# EAGLE design HABduino41 (EAGLE 6.4)
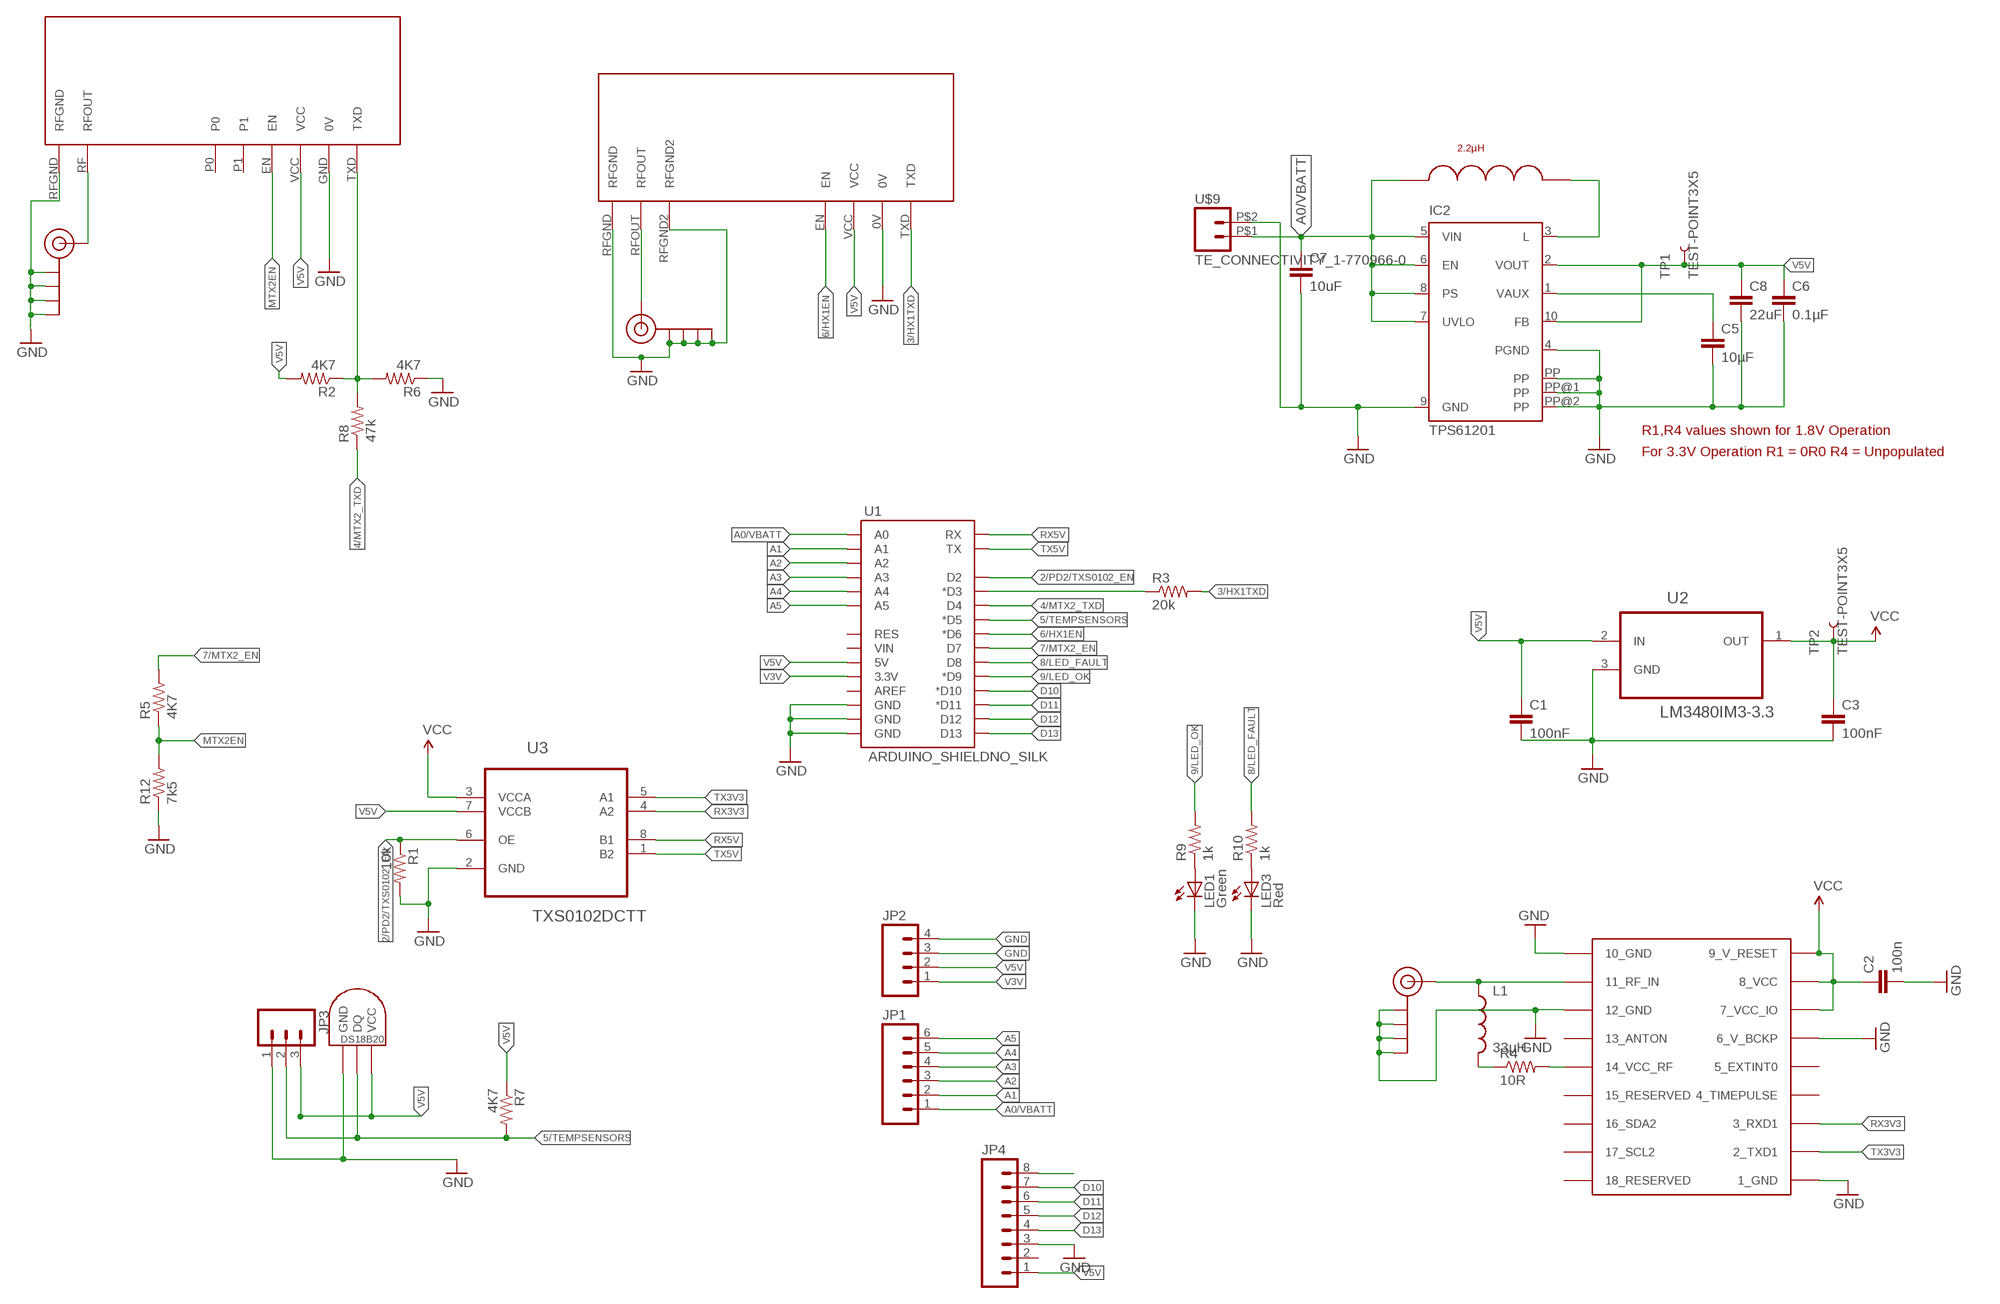
[diagram p0: schematic, sheet 1]

## Parts
C1  100nF  CAP0603-CAP  [0603-CAP]
C2  100n  CAP0603-CAP  [0603-CAP]
C3  100nF  CAP0603-CAP  [0603-CAP]
C5  10µF  CAP0603-CAP  [0603-CAP]
C6  0.1µF  CAP0603-CAP  [0603-CAP]
C7  10uF  CAP1206  [1206]
C8  22uF  CAP1206  [1206]
IC2  TPS61201  [S-PDSO-N10]
J$1  SMA_EDGE  [SMA-EDGE]
J$2  SMA_EDGE  [SMA-EDGE]
J$4  SMA_EDGE  [SMA-EDGE]
JP1  M06SIP  [1X06]
JP2  M04PTH  [1X04]
JP3  M03PTH  [1X03]
JP4  M081X08  [1X08]
L1  33µH  INDUCTOR0603  [0603]
LED1  Green  LED0603  [LED-0603]
LED3  Red  LED0603  [LED-0603]
LPS4018  2.2µH  COILCRAFT_LPS4018  [COILCRAFT_LPS4018]
R1  10k  RESISTOR0603-RES  [0603-RES]
R2  4K7  RESISTOR0603-RES  [0603-RES]
R3  20k  RESISTOR0603-RES  [0603-RES]
R4  10R  RESISTOR0603-RES  [0603-RES]
R5  4K7  RESISTOR0603-RES  [0603-RES]
R6  4K7  RESISTOR0603-RES  [0603-RES]
R7  4K7  RESISTOR0603-RES  [0603-RES]
R8  47k  RESISTOR0603-RES  [0603-RES]
R9  1k  RESISTOR0603-RES  [0603-RES]
R10  1k  RESISTOR0603-RES  [0603-RES]
R12  7k5  RESISTOR0603-RES  [0603-RES]
TEMP  DS1821  DS1820SOIC  [DS18B20_SOIC]
TP1  TEST-POINT3X5  [PAD.03X.05]
TP2  TEST-POINT3X5  [PAD.03X.05]
U1  ARDUINO_SHIELDNO_SILK  [DUEMILANOVE_VIAS]
U2  LM3480IM3-3.3  [SOT95P251X112-3N]
U3  TXS0102DCTT  [SOP65P400X130-8N]
U$1  UBLOX_MAX  [UBLOX_MAX]
U$2  RADIOMETRIX-HX1  [RADIOMETRIX-HX1]
U$4  RADIOMETRIX-MTX2  [RADIOMETRIX-MTX2]
U$9  TE_CONNECTIVITY_1-770966-0  [TE_CONNECTIVITY_1-770966-0]

## Nets
2/PD2/TXS0102_EN: R1.1 U1.D2 U3.6(OE)
3/HX1TXD: R3.2 U$2.TXD
4/MTX2_TXD: R8.1 U1.D4
5/TEMPSENSORS: JP3.2 R7.2 TEMP.DQ U1.D5(*D5)
6/HX1EN: U1.D6(*D6) U$2.EN
7/MTX2_EN: R5.2 U1.D7
8/LED_FAULT: R10.2 U1.D8
9/LED_OK: R9.2 U1.D9(*D9)
A0/VBATT [vcc]: C7.1 IC2.5(VIN) IC2.6(EN) IC2.7(UVLO) IC2.8(PS) JP1.1 LPS4018.P$1 U1.A0 U$9.P$1
A1: JP1.2 JP4.8 U1.A1
A2: JP1.3 U1.A2
A3: JP1.4 U1.A3
A4: JP1.5 U1.A4
A5: JP1.6 U1.A5
D10: JP4.7 U1.D10(*D10)
D11: JP4.6 U1.D11(*D11)
D12: JP4.5 U1.D12
D13: JP4.4 U1.D13
GND [vcc]: C1.2 C2.2 C3.2 C5.2 C6.2 C7.2 C8.2 IC2.4(PGND) IC2.9(GND) IC2.PP IC2.PP@1(PP) IC2.PP@2(PP) J$1.GND@0(GND) J$1.GND@1(GND) J$1.GND@2(GND) J$1.GND@3(GND) J$2.GND@0(GND) J$2.GND@1(GND) J$2.GND@2(GND) J$2.GND@3(GND) J$4.GND@0(GND) J$4.GND@1(GND) J$4.GND@2(GND) J$4.GND@3(GND) JP2.3 JP2.4 JP3.1 JP4.3 LED1.C LED3.C R1.2 R6.1 R12.1 TEMP.GND U1.GND@0(GND) U1.GND@1(GND) U1.GND@2(GND) U2.3(GND) U3.2(GND) U$1.1_GND U$1.6_V_BCKP U$1.10_GND U$1.12_GND U$2.0V U$2.RFGND U$2.RFGND2 U$4.GND(0V) U$4.RFGND U$9.P$2
MTX2EN: R5.1 R12.2 U$4.EN
N$2: R3.1 U1.D3(*D3)
N$3: J$1.SIG(SIGNAL) U$4.RF(RFOUT)
N$4: J$2.SIG(SIGNAL) L1.1 U$1.11_RF_IN
N$5: IC2.3(L) LPS4018.P$2
N$6: J$4.SIG(SIGNAL) U$2.RFOUT
N$7: R2.1 R6.2 R8.2 U$4.TXD
N$11: C5.1 IC2.1(VAUX)
N$12: LED1.A R9.1
N$13: LED3.A R10.1
N$14: L1.2 R4.1
N$15: R4.2 U$1.14_VCC_RF
RX3V3: U3.4(A2) U$1.3_RXD1
RX5V: U1.RX U3.8(B1)
TX3V3: U3.5(A1) U$1.2_TXD1
TX5V: U1.TX U3.1(B2)
V3V: JP2.1 U1.3.3V
V5V: C1.1 C6.1 C8.1 IC2.2(VOUT) IC2.10(FB) JP2.2 JP3.3 JP4.1 R2.2 R7.1 TEMP.VCC TP1.P$1 U1.5V U2.2(IN) U3.7(VCCB) U$2.VCC U$4.VCC
VCC: C2.1 C3.1 TP2.P$1 U2.1(OUT) U3.3(VCCA) U$1.7_VCC_IO U$1.8_VCC U$1.9_V_RESET
Unconnected: JP4.2 U1.AREF U1.RES U1.VIN U$1.4_TIMEPULSE U$1.5_EXTINT0 U$1.13_ANTON U$1.15_RESERVED U$1.16_SDA2 U$1.17_SCL2 U$1.18_RESERVED U$4.P0 U$4.P1

## Notes on the sheet
- R1,R4 values shown for 1.8V Operation
- For 3.3V Operation R1 = 0R0 R4 = Unpopulated

## Library data of the parts
C1-C3 C5-C8 = SparkFun:CAP: Capacitor Standard 0603 ceramic capacitor, and 0.1" leaded capacitor.
IC2 = texas:TPS6120*: LOW INPUT VOLTAGE SYNCHRONOUS BOOST CONVERTER WITH 1.3-A SWITCHES Source: http://focus.ti.com/lit/ds/symlink/tps61200.pdf; MPN: TPS61201DRCT; OC_FARNELL: unknown; OC_NEWARK: 37M0068
J$1 J$2 J$4 = SparkFun:SMA_EDGE: SMA Antenna Connector End launch SMA connector. The paste layer has been removed so that the connector can be hand soldered onto the board after reflow.
JP1 = SparkFun:M06: Header 6 Standard 6-pin 0.1" header. Use with straight break away headers (SKU : PRT-00116), right angle break away headers (PRT-00553), swiss pins (PRT-00743), machine pins (PRT-00117), and female headers (PRT-00115). Molex polarized connector foot print use with SKU : PRT-08094 with associated crimp pins and housings. NOTES ON THE VARIANTS LOCK and LOCK_LONGPADS... This footprint was designed to help hold the alignment of a through-hole component (i.e. 6-pin header) while soldering it into place. You may notice that each hole has been shifted either up or down by 0.005 of an inch from it's more standard position (which is a perfectly straight line). This slight alteration caused the pins (the squares in the middle) to touch the edges of the holes. Because they are alternating, it causes a "brace" to hold the component in place. 0.005 has proven to be the perfect amount of "off-center" position when using our standard breakaway headers. Although looks a little odd when you look at the bare footprint, once you have a header in there, the alteration is very hard to notice. Also, if you push a header all the way into place, it is covered up entirely on the bottom side. This idea of altering the position of holes to aid alignment will be further integrated into the Sparkfun Library for other footprints. It can help hold any component with 3 or more connection pins.
JP2 = SparkFun:M04: Header 4 Standard 4-pin 0.1" header. Use with straight break away headers (SKU : PRT-00116), right angle break away headers (PRT-00553), swiss pins (PRT-00743), machine pins (PRT-00117), and female headers (PRT-00115). Molex polarized connector foot print use with SKU : PRT-08231 with associated crimp pins and housings. 1MM SMD Version SKU: PRT-10208
JP3 = SparkFun:M03: Header 3 Standard 3-pin 0.1" header. Use with straight break away headers (SKU : PRT-00116), right angle break away headers (PRT-00553), swiss pins (PRT-00743), machine pins (PRT-00117), and female headers (PRT-00115). Molex polarized connector foot print use with SKU : PRT-08232 with associated crimp pins and housings.
JP4 = SparkFun:M08: Header 8 Standard 8-pin 0.1" header. Use with straight break away headers (SKU : PRT-00116), right angle break away headers (PRT-00553), swiss pins (PRT-00743), machine pins (PRT-00117), and female headers (PRT-00115).
L1 = SparkFun:INDUCTOR: Inductors Basic Inductor/Choke - 0603 and 1206. Footprints are not proven and vary greatly between part numbers.
LED1 LED3 = SparkFun:LED: LEDs Standard schematic elements and footprints for 5mm, 3mm, 1206, and 0603 sized LEDs. 5mm - Spark Fun Electronics SKU : COM-00529 (and others)
LPS4018 = StevesCoilCraft:COILCRAFT_LPS4018: CoilCraft LPS4018 series inductor
R1-R10 R12 = SparkFun:RESISTOR: Resistor Basic schematic elements and footprints for 0603, 1206, and PTH resistors.
TEMP = ava:DS1820: DS18B20 Programmable Resolution 1-Wire Digital Thermometer Description The DS18B20 digital thermometer provides 9-bit to 12-bit Celsius temperature measurements and has an alarm function with nonvolatile user-programmable upper and lower trigger points. The DS18B20 communicates over a 1-Wire® bus that by definition requires only one data line (and ground) for communication with a central microprocessor. It has an operating temperature range of -55°C to +125°C and is accurate to ±0.5°C over the range of -10°C to +85°C. In addition, the DS18B20 can derive power directly from the data line ("parasite power"), eliminating the need for an external power supply. Each DS18B20 has a unique 64-bit serial code, which allows multiple DS18B20s to function on the same 1-Wire bus. Thus, it is simple to use one microprocessor to control many DS18B20s distributed over a large area. Applications that can benefit from this feature include HVAC environmental controls, temperature monitoring systems inside buildings, equipment, or machinery, and process monitoring and control systems.
TP1 TP2 = SparkFun:TEST-POINT
U1 = SparkFun:ARDUINO_SHIELD
U2 = ava:LM3480IM3-3.3: Low-Dropout Linear Voltage; MPN: LM3480IM3-3.3; OC_FARNELL: 1469102; OC_NEWARK: 41K4825; PACKAGE: SOT-3; SUPPLIER: National Semiconductor
U3 = ava:TXS0102DCTT: BIDIRECTIONAL VOLTAGE-LEVEL TRANSLATOR; MPN: TXS0102DCTT; OC_FARNELL: 1567203; OC_NEWARK: 48M1002; PACKAGE: SSOP-8; SUPPLIER: Texas Instruments
U$1 = ava:UBLOX_MAX: UBLOX MAX
U$2 = ava:RADIOMETRIX-HX1
U$4 = ava:RADIOMETRIX-MTX2
U$9 = ava:TE_CONNECTIVITY_1-770966-0; FARNELL: 1098556

## Net classes
0 default: width 0.203 mm
1 vcc: width 0.254 mm
2 gnd: width 0.305 mm, drill 0.508 mm, clearance 0.152 mm

## Board
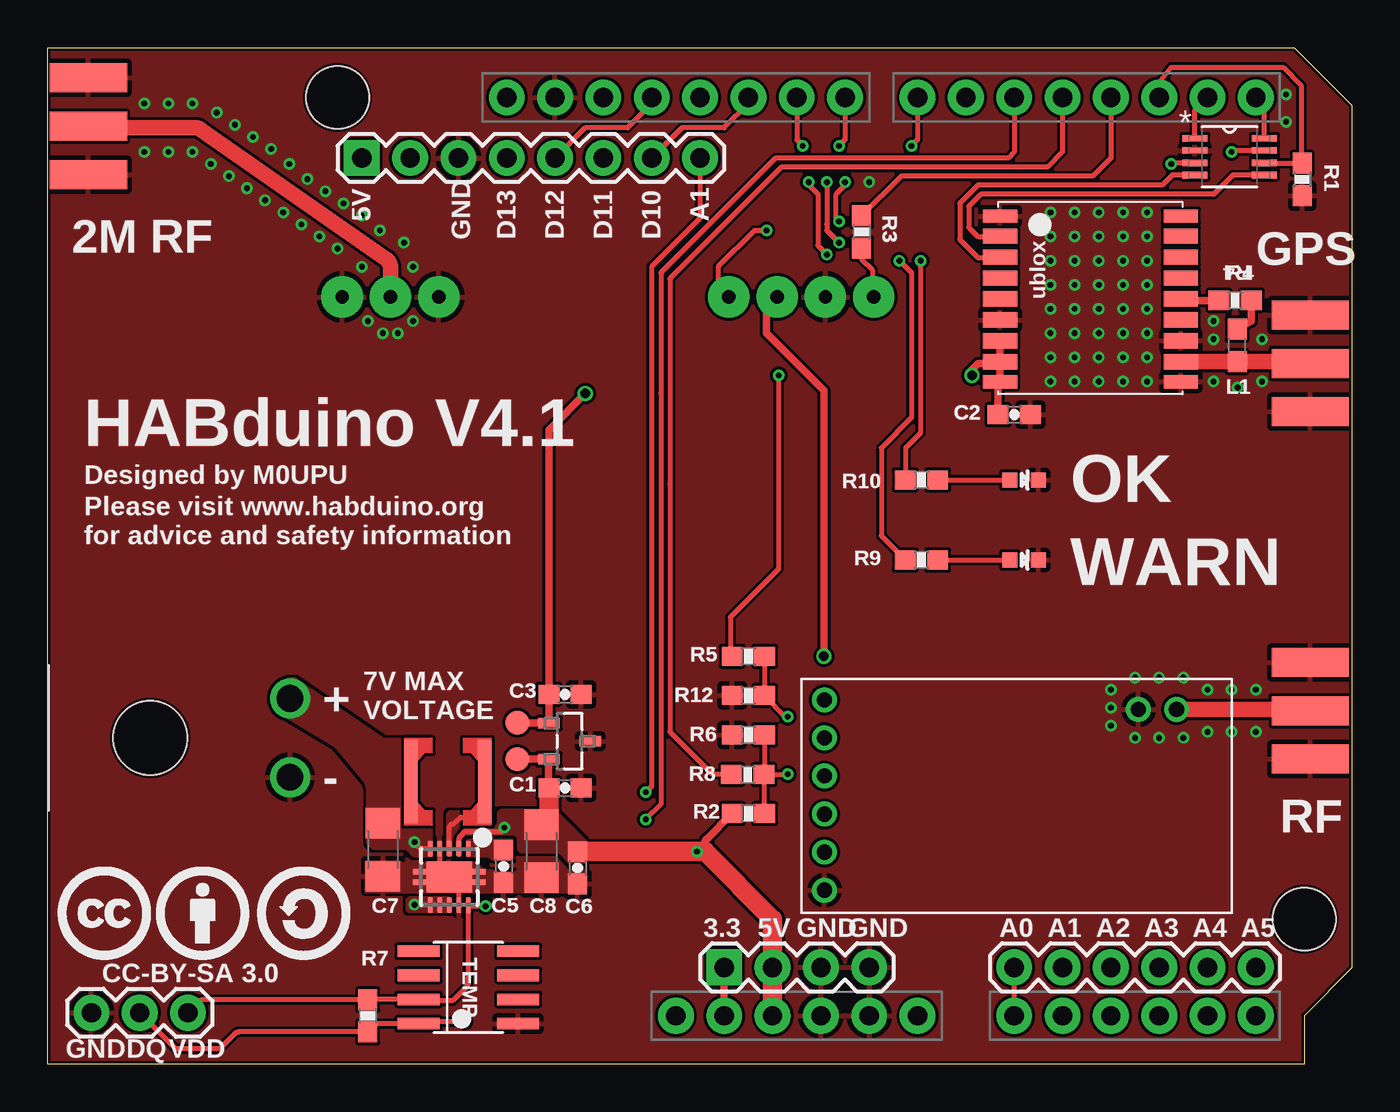
[diagram p1: board, top side]
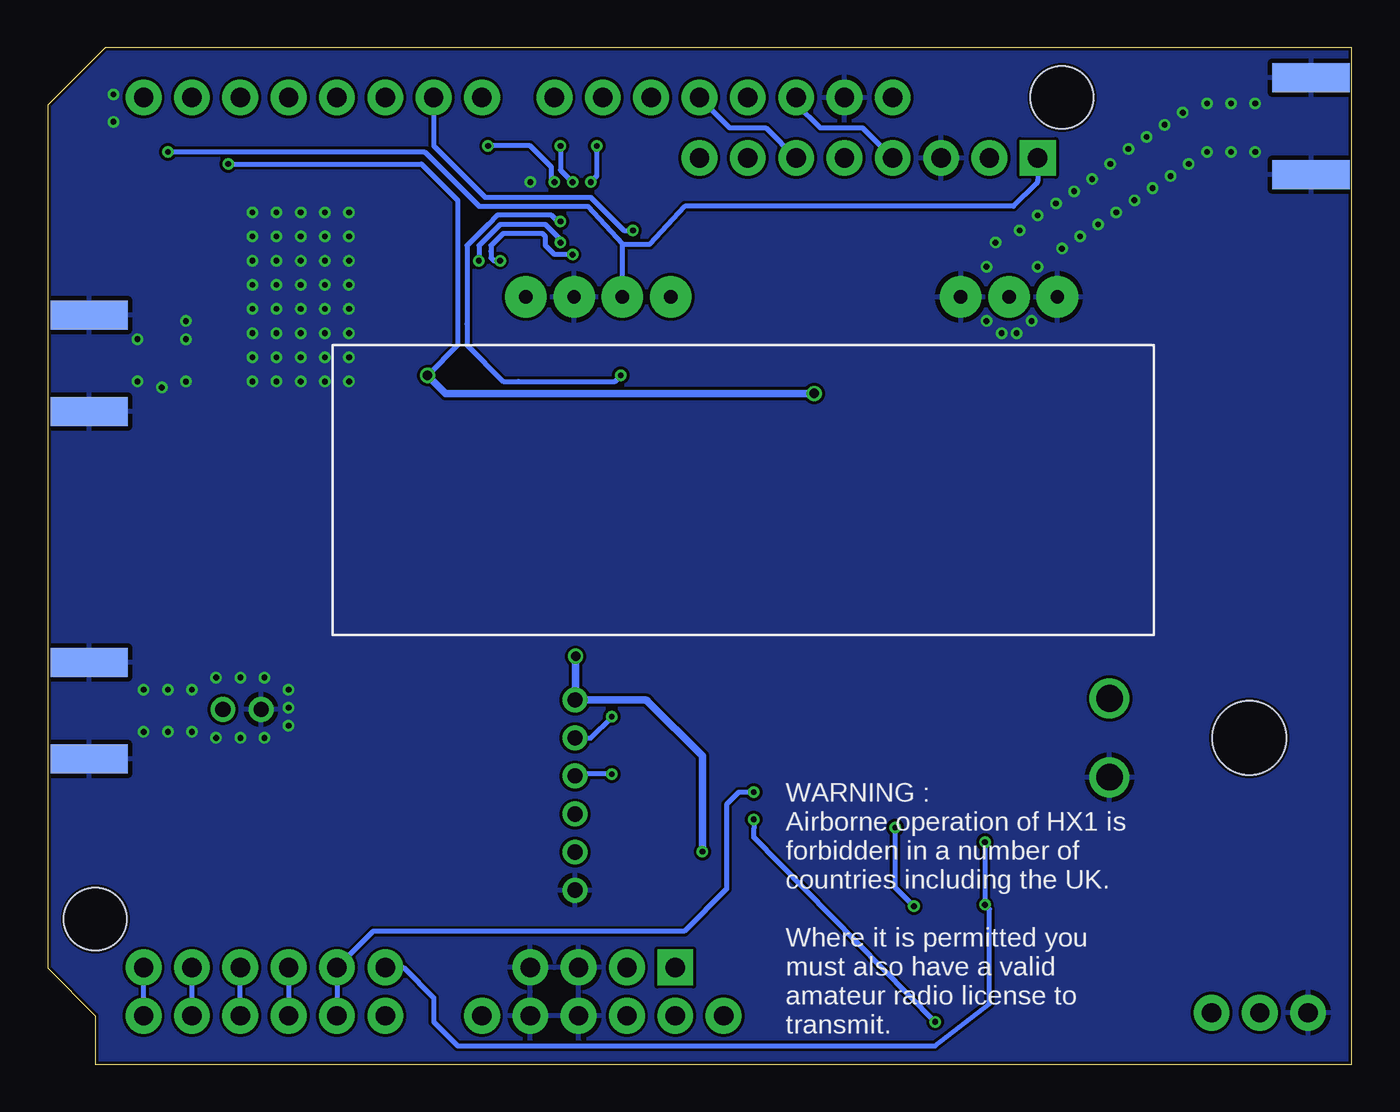
[diagram p2: board, bottom side, seen from below]

Size 68.55 x 53.43 mm. Coordinates in mm from the lower left corner, seen from the top.
Outline: 0,53.43 65.52,53.43 68.55,50.4 68.55,5.05 68.53,5.05 66.04,2.54 66.04,0 0,0 0,53.43
Copper layers (1*16): Top 0.035mm / dielectric 1.5mm / Bottom 0.035mm
Design rules "Hackvana": minimum track width 6mil, minimum drill 0.3mm, track to track 6mil, track to pad 6mil, pad to pad 6mil, via to via 6mil, smd to smd 0mil, copper to edge 6mil, drill to drill 6mil, minimum pad ring 10mil, minimum via ring 6mil, stop-mask expansion 2mil, vias tented up to drill 100mil, thermal gap 10mil
Holes 3.3 mm at 66.04,7.62 15.24,50.8

### Footprints (pad centres in the part's own frame; a part is rotated, then mirrored left to right if it is on the bottom)
0603-CAP = smd 1.1 x 1: 1 -0.85,0; 2 0.85,0
1206 = smd 1.6 x 1.8: 1 -1.4,0; 2 1.4,0
S-PDSO-N10 = smd 0.28 x 0.85: 1 -1,-1.475; 2 -0.5,-1.475; 3 0,-1.475; 4 0.5,-1.475; 5 1,-1.475; 6 1,1.475; 7 0.5,1.475; 8 0,1.475; 9 -0.5,1.475; 10 -1,1.475 | smd 2.4 x 1.65: PP 0,0 | smd 3.8 x 0.28: PP@1 0,0.275; PP@2 0,-0.275
SMA-EDGE = smd 1.524 x 4.064: GND@0 -2.54,0; GND@1 2.54,0; SIG 0,0 | smd 1.524 x 4.064 bottom: GND@2 -2.54,0; GND@3 2.54,0
1X06 = drill 1.016 pad 1.88: 1 0,0; 2 2.54,0; 3 5.08,0; 4 7.62,0; 5 10.16,0; 6 12.7,0
1X04 = drill 1.016 pad 1.88 square: 1 0,0 | drill 1.016 pad 1.88: 2 2.54,0; 3 5.08,0; 4 7.62,0
1X03 = drill 1.016 pad 1.88: 1 0,0; 2 2.54,0; 3 5.08,0
1X08 = drill 1.016 pad 1.88 square: 1 0,0 | drill 1.016 pad 1.88: 2 2.54,0; 3 5.08,0; 4 7.62,0; 5 10.16,0; 6 12.7,0; 7 15.24,0; 8 17.78,0
0603 = smd 1.1 x 1: 1 -0.85,0; 2 0.85,0
LED-0603 = smd 0.8 x 0.8: A 0,-0.75; C 0,0.75
COILCRAFT_LPS4018 = smd 0.7 x 4.4: P$1 -1.95,0; P$2 1.95,0
0603-RES = smd 1.1 x 1: 1 -0.85,0; 2 0.85,0
DS18B20_SOIC = smd 0.61 x 2.21: DQ 1.905,-2.616; GND 1.905,2.616; NC -1.905,-2.616; NC2 -0.635,-2.616; NC3 -1.905,2.616; NC4 -0.635,2.616; NC5 0.635,2.616; VCC 0.635,-2.616
PAD.03X.05 = smd 1.27 x 1.27: P$1 0,0
DUEMILANOVE_VIAS = drill 1.016 pad 1.88: 3.3V 50.8,13.97; 5V 50.8,16.51; A0 50.8,29.21; A1 50.8,31.75; A2 50.8,34.29; A3 50.8,36.83; A4 50.8,39.37; A5 50.8,41.91; AREF 2.54,2.54; D2 2.54,36.83; D3 2.54,34.29; D4 2.54,31.75; D5 2.54,29.21; D6 2.54,26.67; D7 2.54,24.13; D8 2.54,20.32; D9 2.54,17.78; D10 2.54,15.24; D11 2.54,12.7; D12 2.54,10.16; D13 2.54,7.62; GND@0 50.8,19.05; GND@1 50.8,21.59; GND@2 2.54,5.08; RES 50.8,11.43; RX 2.54,41.91; TX 2.54,39.37; VIN 50.8,24.13
SOT95P251X112-3N = smd 0.559 x 1.143: 1 -0.94,-1.092; 2 0.94,-1.092; 3 0,1.092
SOP65P400X130-8N = smd 1.321 x 0.356: 1 -1.829,0.965; 2 -1.829,0.33; 3 -1.829,-0.33; 4 -1.829,-0.965; 5 1.829,-0.965; 6 1.829,-0.33; 7 1.829,0.33; 8 1.829,0.965
UBLOX_MAX = smd 1.8 x 0.7: 1_GND 4.95,-4.4; 9_V_RESET 4.95,4.3; 10_GND -4.55,4.3; 18_RESERVED -4.55,-4.4 | smd 1.8 x 0.8: 2_TXD1 4.95,-3.35; 3_RXD1 4.95,-2.25; 4_TIMEPULSE 4.95,-1.15; 5_EXTINT0 4.95,-0.05; 6_V_BCKP 4.95,1.05; 7_VCC_IO 4.95,2.15; 8_VCC 4.95,3.25; 11_RF_IN -4.55,3.25; 12_GND -4.55,2.15; 13_ANTON -4.55,1.05; 14_VCC_RF -4.55,-0.05; 15_RESERVED -4.55,-1.15; 16_SDA2 -4.55,-2.25; 17_SCL2 -4.55,-3.35
RADIOMETRIX-HX1 = drill 0.7 pad 2.184: 0V 8.89,-10.16; EN 3.81,-10.16; RFGND -11.43,-10.16; RFGND2 -16.51,-10.16; RFOUT -13.97,-10.16; TXD 11.43,-10.16; VCC 6.35,-10.16
RADIOMETRIX-MTX2 = drill 0.8: EN 9.97,-3.25; GND 9.97,4.75; P0 9.97,2.75; P1 9.97,0.75; RF -8.53,-4.75; RFGND -6.53,-4.75; TXD 9.97,-1.25; VCC 9.97,-5.25
TE_CONNECTIVITY_1-770966-0 = drill 1.4: P$1 -2.07,7.34; P$2 2.07,7.34 | hole 3.9: 0,0

### Placement (x,y rotation side)
C1  27.19,14.51 0 top
C2  50.8,34.13 0 top
C3  27.19,19.43 0 top
C5  23.97,10.4 270 top
C6  27.86,10.32 270 top
C7  17.62,11.27 270 top
C8  25.96,11.19 270 top
IC2  21.11,9.84 180 top
J$1  66.36,18.57 90 top
J$2  66.36,36.83 90 top
J$4  2.14,49.29 90 top
JP1  50.8,5.08 0 top
JP2  35.56,5.08 0 top
JP3  2.3,2.7 0 top
JP4  16.51,47.62 0 top
L1  62.52,37.77 90 top
LED1  51.32,26.5 270 top
LED3  51.32,30.7 270 top
LPS4018  21.03,14.84 0 top
R1  65.93,46.5 270 top
R2  36.83,13.18 180 top
R3  42.78,43.74 270 top
R4  62.41,40.14 180 top
R5  36.83,21.43 180 top
R6  36.83,17.3 0 top
R7  16.83,2.54 270 top
R8  36.8,15.22 0 top
R9  45.93,26.5 180 top
R10  45.93,30.7 180 top
R12  36.83,19.37 0 top
TEMP  22.11,4.03 270 top
TP1  24.69,16.03 0 top
TP2  24.69,17.94 0 top
U1  21.59,53.34 270 top
U2  27.43,16.97 270 top
U3  62.12,47.69 0 top
U$1  55.01,40.16 180 top
U$2  31.99,30.16 180 bottom
U$3  [CC]  0.55,5.5 0 top
U$4  50.8,13.89 180 top
U$5  [CC-BY-21]  5.71,5.5 0 top
U$6  [CC-SA-21]  11.03,5.5 0 top
U$9  5.4,17.14 270 top

### Tracks (layer width: path | path; a pad name or v marks a point on that pad's centre or on a via)
2/PD2/TXS0102_EN
  Top 0.254: 66.24,46.88 R1.1 | U1.D2 58.42,51.59 59.05,52.39 64.93,52.39 65.88,51.44 65.88,47.4 R1.1 | U3.6 65.92,47.36 R1.1
3/HX1TXD
  Top 0.254: R3.2 42.78,42.31 43.34,41.75 43.34,40.4 U$2.TXD
4/MTX2_TXD
  Top 0.254: U1.D4 53.34,47.94 52.55,47.15 38.58,47.15 32.7,41.27 32.7,30.48 32.7,17.46 34.92,15.24 35.93,15.24 R8.1
5/TEMPSENSORS  (via drill 0.3, 0.3 pad 0.25)
  Top 0.254: JP3.2 6.67,0.87 arc45 6.85,0.79 9.05,0.79 9.87,1.62 arc-45 10.05,1.69 R7.2 17.19,2.05 arc-45 17.37,2.13 TEMP.DQ 19.59,2.22 v21.91,2.22 | U1.D5 50.8,47.94 50.48,47.62 38.26,47.62 32.38,41.75 32.23,41.59 32.23,35.24 32.23,13.65 v31.43,12.86
  Bottom 0.254: v21.91,2.22 31.43,11.91 31.43,12.38 v31.43,12.86
6/HX1EN  (via drill 0.3)
  Top 0.254: v37.78,43.81 37.15,43.81 35.24,41.91 35.24,40.4 U$2.EN
  Bottom 0.254: U1.D6 48.26,48.26 45.56,45.56 40.01,45.56 38.26,43.81 v37.78,43.81
7/MTX2_EN  (via drill 0.3)
  Top 0.254: U1.D7 45.72,48.58 v45.4,48.26 | v38.42,36.2 38.42,26.04 35.88,23.5 35.88,21.53 R5.2 | v41.59,44.29 41.43,44.45 41.43,45.72 41.91,46.2 v41.91,46.35
  Bottom 0.254: v41.91,46.35 42.07,46.35 42.07,47.15 43.18,48.26 v45.4,48.26 | v41.59,44.29 41.75,44.29 42.07,44.61 44.93,44.61 45.4,44.13 46.51,43.02 46.51,38.89 46.51,37.78 44.61,35.88 43.81,35.88 38.73,35.88 v38.42,36.2
8/LED_FAULT  (via drill 0.3)
  Top 0.254: U1.D8 41.91,48.58 v41.59,48.26 | v40.96,46.35 40.96,44.13 40.96,43.81 v41.59,43.18 | v45.88,42.23 45.88,33.18 45.09,32.38 R10.2
  Bottom 0.254: v41.59,48.26 41.59,46.99 v40.96,46.35 | v41.59,43.18 41.59,43.34 42.39,44.13 44.77,44.13 45.88,43.02 v45.88,42.23
9/LED_OK  (via drill 0.3)
  Top 0.254: U1.D9 39.37,48.58 v39.69,48.26 | v40.01,46.35 40.01,46.2 40.48,45.72 40.48,43.02 v40.96,42.55 | v44.77,42.23 45.4,41.59 45.4,33.97 43.81,32.38 43.81,27.76 R9.2
  Bottom 0.254: v39.69,48.26 39.69,46.67 v40.01,46.35 | v40.96,42.55 41.91,42.55 42.39,43.02 42.39,43.5 42.55,43.66 44.61,43.66 45.24,43.02 45.24,42.7 45.24,42.39 45.09,42.23 v44.77,42.23
A0/VBATT  (via drill 0.3)
  Top 0.254: IC2.5 19.64,11.32 v19.29,11.67 | v19.29,8.37 IC2.6 | U1.A0 JP1.1
  Bottom 0.254: v19.29,11.67 v19.29,8.37 19.05,8.14 19.05,3.17 21.91,0.95 46.99,0.95 48.26,2.22 48.26,3.49 49.85,5.08 JP1.1
  pour Top (no thermals): 19.06,8.81 21.02,8.81 arc-90 21.27,8.56 21.27,8.19 arc-90 21.02,7.94 19.06,7.94 arc-90 18.81,8.19 18.81,8.56 arc-90
  pour Top (no thermals): 15.19,16.54 16.51,14.96 arc-40 16.75,14.32 16.75,11.69 arc45 16.82,11.52 16.99,11.34 arc45 17.17,11.27 18.71,11.27 arc-45 18.89,11.2 19.14,10.95 arc45 19.31,10.87 20.24,10.87 20.24,13.26 20.16,13.34 19.76,13.34 19.37,13.73 19.37,16.03 19.76,16.43 20.24,16.43 20.24,17.14 17.72,17.14 arc-45 17.55,17.22 13.08,20.28 arc34 12.94,20.32 12.7,20.32 11.99,19.92 11.91,18.57 14.94,16.75 arc-19
A1  (via drill 0.3)
  Top 0.254: JP4.8 34.29,44.45 31.75,41.91 31.75,35.56 31.75,14.61 v31.43,14.29
  Bottom 0.254: U1.A1 JP1.2 51.44,6.99 35.08,6.99 32.86,9.21 32.86,13.65 32.23,14.29 v31.43,14.29
A2
  Bottom 0.254: JP1.3 U1.A2
A3
  Bottom 0.254: U1.A3 JP1.4
A4
  Bottom 0.254: U1.A4 JP1.5
A5
  Bottom 0.254: U1.A5 JP1.6
D10
  Top 0.254: U1.D10 36.83,50.48 35.56,49.21 33.34,49.21 JP4.7
D11
  Bottom 0.254: U1.D11 32.7,49.21 30.8,49.21 JP4.6
D12
  Top 0.254: U1.D12 31.75,50.48 30.48,49.21 28.26,49.21 JP4.5
D13
  Bottom 0.254: U1.D13 29.21,50.48 27.94,49.21 25.72,49.21 JP4.4
GND  (via drill 0.3)
  Top 0.254: 20.6,11.31 20.6,10.04 | 21.63,8.37 21.63,9.6
  other vias: 65.09,50.96 65.09,49.53 43.18,46.35 19.21,41.91 16.51,41.91 16.83,39.05 19.21,39.05 18.41,38.42 17.62,38.42 15.24,42.86 18.73,43.18 17.46,43.81 14.29,43.5 16.51,44.61 15.56,45.24 14.61,45.88 13.65,46.51 12.7,47.31 13.34,44.13 12.38,44.77 11.43,45.4 10.48,46.04 9.53,46.67 8.57,47.31 7.62,47.94 6.35,47.94 5.08,47.94 11.75,48.1 10.79,48.74 9.84,49.37 8.89,50.01 7.62,50.48 6.35,50.48 5.08,50.48 63.5,19.68 62.23,19.68 60.96,19.68 59.69,20.32 58.42,20.32 57.15,20.32 55.88,19.68 55.88,17.78 57.15,17.14 58.42,17.14 59.69,17.14 63.5,17.46 62.23,17.46 60.96,17.46 55.88,18.73 57.78,43.5 63.82,38.1 63.82,35.88 61.28,38.1 61.28,39.05 61.28,35.88 62.55,35.56 57.78,35.88 57.78,37.15 57.78,38.42 57.78,39.69 57.78,40.96 57.78,42.23 57.78,44.77 56.52,43.5 56.52,35.88 56.52,37.15 56.52,38.42 56.52,39.69 56.52,40.96 56.52,42.23 56.52,44.77 55.24,43.5 55.24,35.88 55.24,37.15 55.24,38.42 55.24,39.69 55.24,40.96 55.24,42.23 55.24,44.77 53.98,43.5 53.98,35.88 53.98,37.15 53.98,38.42 53.98,39.69 53.98,40.96 53.98,42.23 53.98,44.77 52.7,43.5 52.7,35.88 52.7,37.15 52.7,38.42 52.7,39.69 52.7,40.96 52.7,42.23 52.7,44.77
  pour Top (no thermals): 28.34,10.24 27.38,10.24 26.82,10.8 arc45 26.65,10.91 24.94,10.91 arc90 24.69,10.62 24.69,10.33 arc-90 24.44,10.08 23.2,10.08 arc-45 23.02,10.15 22.54,10.64 20.08,10.64 20,10.56 20,9.05 19.92,8.97 28.34,8.97
  pour Top (no thermals): 16.67,10.64 20,10.64 20,8.97 16.67,8.97
  pour Top (rank 2): 0,53.43 65.52,53.43 68.55,50.4 68.58,5.08 66.04,2.54 66.04,0 0,0
  pour Bottom: 0,53.43 65.52,53.43 68.55,50.4 68.58,5.08 66.04,2.54 66.04,0 0,0
MTX2EN  (via drill 0.3 pad 0.25)
  Top 0.254: R5.1 R12.2 38.79,18.26 v38.89,18.26
  Bottom 0.254: U$4.EN 40.01,17.14 v38.89,18.26
N$2
  Top 0.254: U1.D3 55.88,47.62 54.93,46.67 44.87,46.67 R3.1
N$3
  Top 0.813: U$4.RF 66.2,18.64 arc-45 J$1.SIG
N$4
  Top 0.254: L1.1 63.14,36.91
  Top 0.813: U$1.11_RF_IN 63.14,36.91 | L1.1 66.26,36.92 J$2.SIG
N$5
  Top 0.254: IC2.3 21.11,12.4 arc-45 21.19,12.57 21.23,12.62 21.25,12.62 arc45 21.43,12.69 21.71,12.98 22.64,12.98 arc45 22.81,13.05 22.98,13.22 LPS4018.P$2 arc-45 LPS4018.P$2
  pour Top (no thermals): 21.27,10.95 20.95,10.95 20.95,13.09 arc-90 21.2,13.34 22.23,13.34 22.23,12.54 21.85,12.54 arc59 21.64,12.42 21.27,11.83
N$6
  Top 0.813: U$2.RFOUT 18.02,41.89 arc55 17.8,42.3 8.05,49.12 arc35 7.76,49.21 1.27,49.21 0.95,49.53 1.91,49.53 J$4.SIG
N$7  (via drill 0.3)
  Top 0.254: R2.1 37.68,15.15 arc45 R8.2 | R6.2 37.68,15.3 arc-45 R8.2 | R8.2 38.85,15.22 arc45 v38.89,15.24
  Bottom 0.254: v38.89,15.24 40.63,15.24 arc-45 40.8,15.17 U$4.TXD
N$11
  pour Top (no thermals): 21.99,10.87 23.07,10.87 arc-45 23.25,10.8 23.34,10.72 24.45,10.72 24.45,11.83 22.17,11.83 arc45 21.99,11.75 arc45 21.99,11.74
N$12
  Top 0.254: 50.27,26.71 LED1.A 50.26,26.5 R9.1
N$13
  Top 0.254: 50.27,30.92 LED3.A 50.26,30.7 R10.1
N$14
  Top 0.406: R4.1 63.26,39.05 L1.2
N$15
  Top 0.406: R4.2 59.63,40.14 U$1.14_VCC_RF
RX3V3
  Top 0.254: U3.4 59.11,46.72 58.58,46.2 48.9,46.2 47.94,45.24 47.94,43.34 48.9,42.39 50.03,42.39 U$1.3_RXD1
RX5V
  Top 0.254: U3.8 63.95,50.35 U1.RX
TX3V3
  Top 0.254: U3.5 62.28,46.72 61.28,45.72 49.05,45.72 48.42,45.09 48.42,43.97 48.9,43.5 50.04,43.5 U$1.2_TXD1
TX5V
  Top 0.254: U3.1 60.29,50.13 U1.TX
V3V
  Top 0.406: JP2.1 U1.3.3V
V5V  (via drill 0.3, 0.5)
  Top 0.254: U3.7 62.47,48.02 v62.23,47.94 | IC2.2 21.61,11.79 arc-45 21.69,11.96 21.95,12.22 23.83,12.22 arc45 24,12.3 v24.01,12.42 | v23.02,8.29 22.11,8.29 | 22.11,8.29 IC2.10 | 22.11,8.29 22.11,4.27 arc-45 22.03,4.09 21.27,3.33 19.65,3.33 arc-45 TEMP.VCC 16.84,3.4 arc45 R7.1 8.18,3.39 arc45 8,3.32 JP3.3
  Top 0.406: C1.1 U2.2 TP1.P$1 | 34.55,11.17 34.55,11.64 arc-45 34.62,11.82 R2.2 | v40.8,21.43 40.8,35.4 37.78,38.42 37.78,40.24 U$2.VCC
  Top 1.016: C6.1 v34.13,11.17 34.55,11.17 38.1,7.62 JP2.2 U1.5V | C1.1 26.34,12.98 C8.1
  Bottom 0.254: v62.23,47.94 48.74,47.94 45.88,45.09 40.16,45.09 38.34,43.1 | v24.01,12.42 24.01,9.29 v23.02,8.29 | JP4.1 16.51,46.46 arc45 16.58,46.28 17.78,45.09 35.06,45.09 36.88,43.1 38.34,43.1 | U$2.VCC 38.34,43.1
  Bottom 0.406: v34.13,11.17 34.13,16.19 37.01,19.07 arc-45 37.18,19.14 U$4.VCC 40.8,19.17 v40.8,21.43
  pour Top (no thermals): 21.47,10.95 21.47,11.75 arc-33 21.51,11.89 21.75,12.27 arc-57 21.96,12.38 23.3,12.38 arc50 23.49,12.47 23.56,12.55 arc40 23.61,12.71 23.61,13.14 arc-51 23.71,13.33 23.74,13.36 arc-39 23.9,13.41 26.67,13.41 28.34,11.75 28.34,10.56 27.38,10.56 26.9,11.04 arc45 26.73,11.07 24.94,11.07 arc-90 24.69,11.36 24.69,11.78 arc90 24.44,12.03 22.06,12.03 arc50 21.87,11.94 21.75,11.79 21.75,10.95
VCC  (via drill 0.3, 0.5, 0.5 pad 0.25)
  Top 0.254: U3.3 59.11,47.36 v59.05,47.31
  Top 0.406: U$1.7_VCC_IO U$1.8_VCC | U$1.8_VCC U$1.9_V_RESET 49.95,35.76 C2.1 | v48.58,36.2 48.58,36.51 48.9,36.83 49.97,36.83 U$1.8_VCC | TP2.P$1 26.31,17.94 U2.1 C3.1 26.34,26.34 26.34,33.33 v28.26,35.24
  Bottom 0.254: v59.05,47.31 48.9,47.31 46.99,45.4 46.99,38.2 46.99,37.78 v48.58,36.2
  Bottom 0.406: v48.58,36.2 47.62,35.24 29.84,35.24 v28.26,35.24

### Text on the board
tPlace: 5V | A1 | 2M RF | GND | D13 | D12 | D11 | D10 | GPS | HABduino V4.1 | Designed by M0UPU | OK | Please visit www.habduino.org / for advice and safety information | WARN | + | 7V MAX / VOLTAGE | - | RF | 3.3 | 5V | GND | GND | A0 | A1 | A2 | A3 | A4 | A5 | CC-BY-SA 3.0 | GND | DQ | VDD
bPlace: WARNING : / Airborne operation of HX1 is / forbidden in a number of / countries including the UK. / / Where it is permitted you / must also have a valid / amateur radio license to / transmit.
tDocu: (C) HABduino Project 2015 / http://habduino.org / Please visit website for assitance / with legislation and safety advice. / / In most countries you will need to / seek permission to launch a / meteorological balloon. / / http://ukhas.org.uk / http://spacenear.us/tracker | Released under the Creative Commons Attribution Share-Alike 3.0 License | http://creativecommons.org/licenses/by-sa/3.0
_tNames: R1 | R3 | R4 | L1 | C2 | R10 | R9 | R5 | C3 | R12 | R6 | R8 | C1 | R2 | C7 | C5 | C8 | C6 | TEMP | R7